# Altium project Status_board.PrjPCB
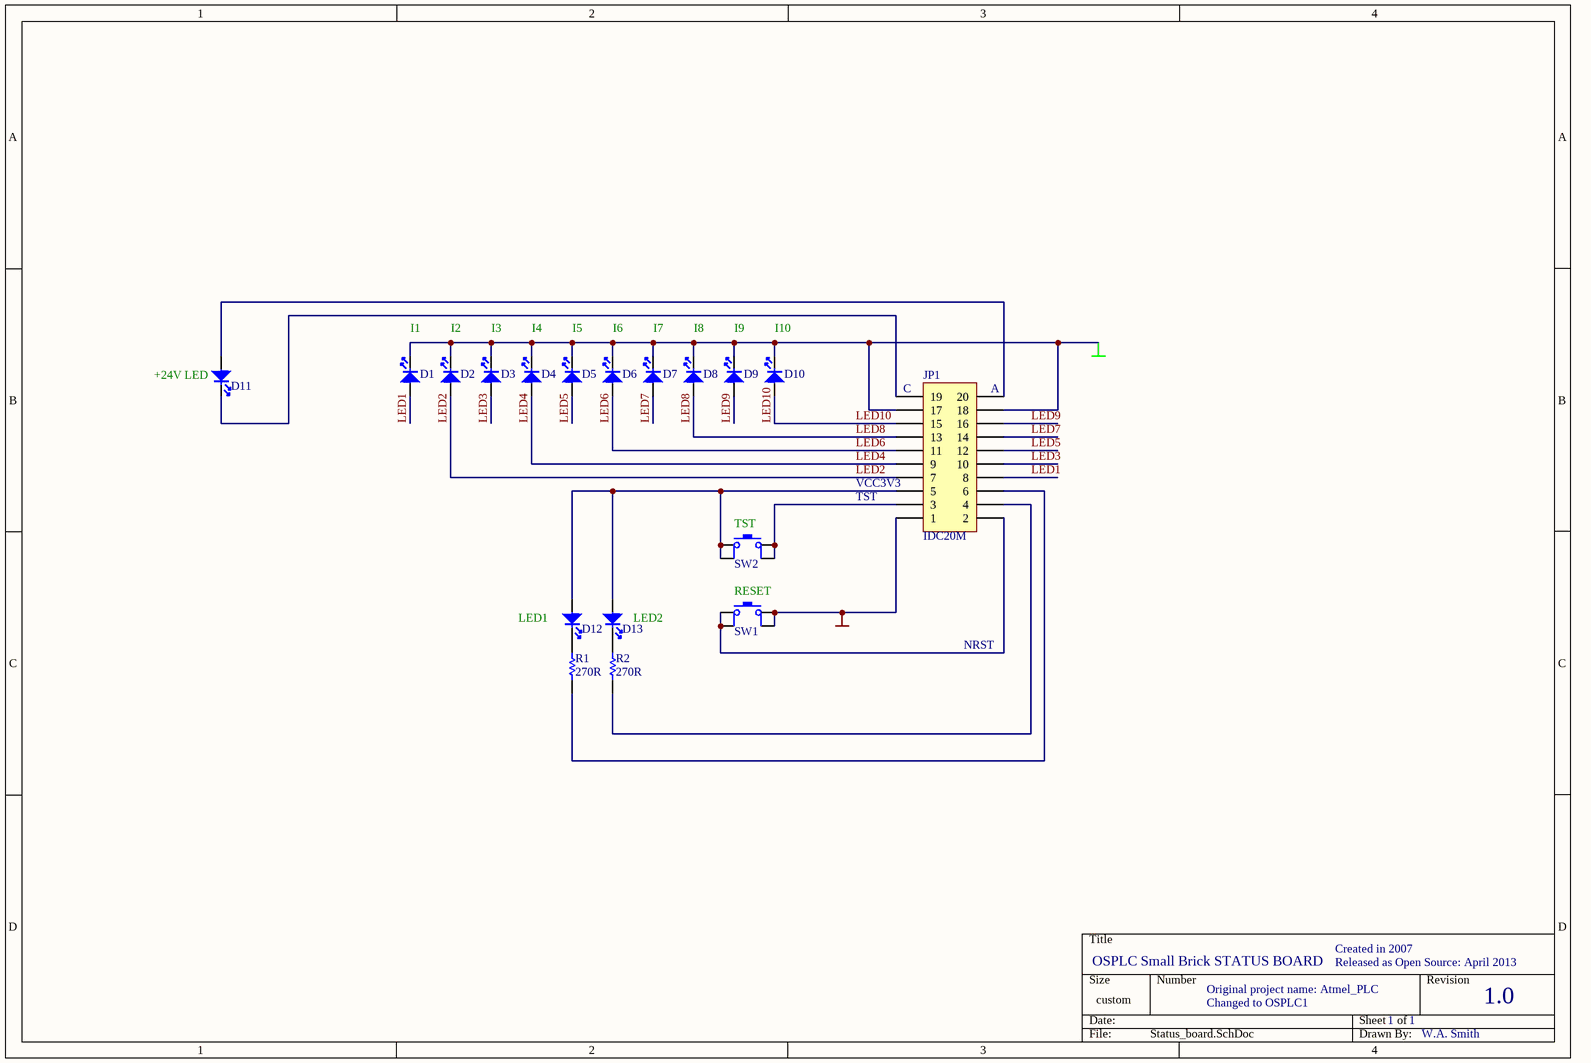
[diagram p0: Status_board.SchDoc]
1 sheet, 18 parts. Net scope: global (net labels, ports and power ports of the same name join across sheets).
Board file: Status_PCB.PcbDoc

## Sheet Status_board.SchDoc
size 294 x 198 mm

### Parts
D1  LED  [1206_LED]  (value not drawn)
D2  LED  [1206_LED]  (value not drawn)
D3  LED  [1206_LED]  (value not drawn)
D4  LED  [1206_LED]  (value not drawn)
D5  LED  [1206_LED]  (value not drawn)
D6  LED  [1206_LED]  (value not drawn)
D7  LED  [1206_LED]  (value not drawn)
D8  LED  [1206_LED]  (value not drawn)
D9  LED  [1206_LED]  (value not drawn)
D10  LED  [1206_LED]  (value not drawn)
D11  LED  [1206_LED]  (value not drawn)
D12  LED  [1206_LED]  (value not drawn)
D13  LED  [1206_LED]  (value not drawn)
JP1  IDC20M  [IDC_20M_BOX]
R1  value 270R  [0805]  (hidden comment: 0805)
R2  value 270R  [0805]  (hidden comment: 0805)
SW1  PB_SWITCH_6x6  [PB_SW_6x6]  (value not drawn)
SW2  PB_SWITCH_6x6  [PB_SW_6x6]  (value not drawn)

### Nets
GND: JP1.1 SW1.3 SW1.4
IN_GND: D1.2 D2.2 D3.2 D4.2 D5.2 D6.2 D7.2 D8.2 D9.2 D10.2 JP1.17 JP1.18
LED1: D1.1 JP1.8
LED2: D2.1 JP1.7
LED3: D3.1 JP1.10
LED4: D4.1 JP1.9
LED5: D5.1 JP1.12
LED6: D6.1 JP1.11
LED7: D7.1 JP1.14
LED8: D8.1 JP1.13
LED9: D9.1 JP1.16
LED10: D10.1 JP1.15
NetD11_1: D11.1 JP1.20
NetD11_2: D11.2 JP1.19
NetD12_1: D12.1 D13.1 JP1.5 SW2.1(SW1) SW2.2(SW2)
NetD12_2: D12.2 R1.2
NetD13_2: D13.2 R2.2
NetJP1_2: JP1.2 SW1.1(SW1) SW1.2(SW2)
NetJP1_3: JP1.3 SW2.3 SW2.4
NetJP1_4: JP1.4 R2.1
NetJP1_6: JP1.6 R1.1

### Notes on the sheet
- I1
- I2
- I3
- I4
- I5
- I6
- I7
- I8
- I9
- I10
- (near D11) +24V LED
- (near JP1) C
- (near JP1) A
- (near SW2) TST
- (near JP1) TST
- (near JP1) VCC3V3
- (near SW1) RESET
- LED1
- LED2
- NRST
- Created in 2007
- OSPLC Small Brick STATUS BOARD
- Original project name: Atmel_PLC
- Changed to OSPLC1
- Released as Open Source: April 2013
- 1.0
- 1
- W.A. Smith

### Library data of the parts
D1-D13 = LED_1206: 1206 footpring LED
JP1 = IDC_20M: 20 pin IDC male connector, vertical, box
R1 R2 = RES_0805: 0805 footprint resistor
SW1 SW2 = PB_SWITCH_6x6: Tact Switch 6mm x 6mm